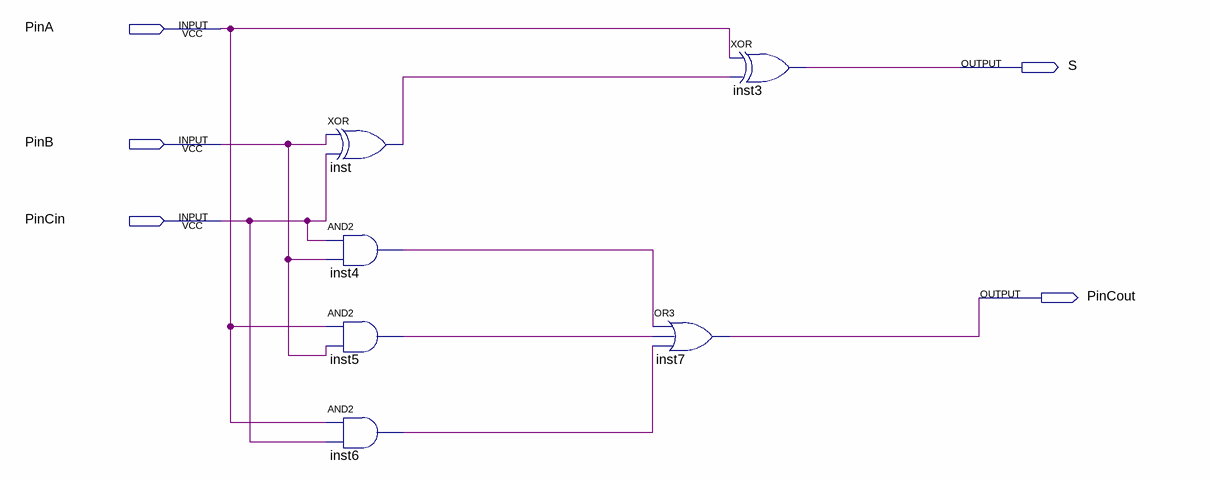
[diagram p0: schematic sheet]
// Quartus schematic Projeto_Adder.bdf as structural Verilog: 6 symbols, 5 pins
module Projeto_Adder (
  input  PinA,
  input  PinB,
  input  PinCin,
  output S,
  output PinCout
);

  wire inst4_out, inst5_out, inst6_out, inst_out;

  xor inst (inst_out, PinB, PinCin);
  and inst4 (inst4_out, PinCin, PinB);
  and inst5 (inst5_out, PinA, PinB);
  and inst6 (inst6_out, PinA, PinCin);
  or inst7 (PinCout, inst4_out, inst5_out, inst6_out);
  xor inst3 (S, PinA, inst_out);
endmodule
